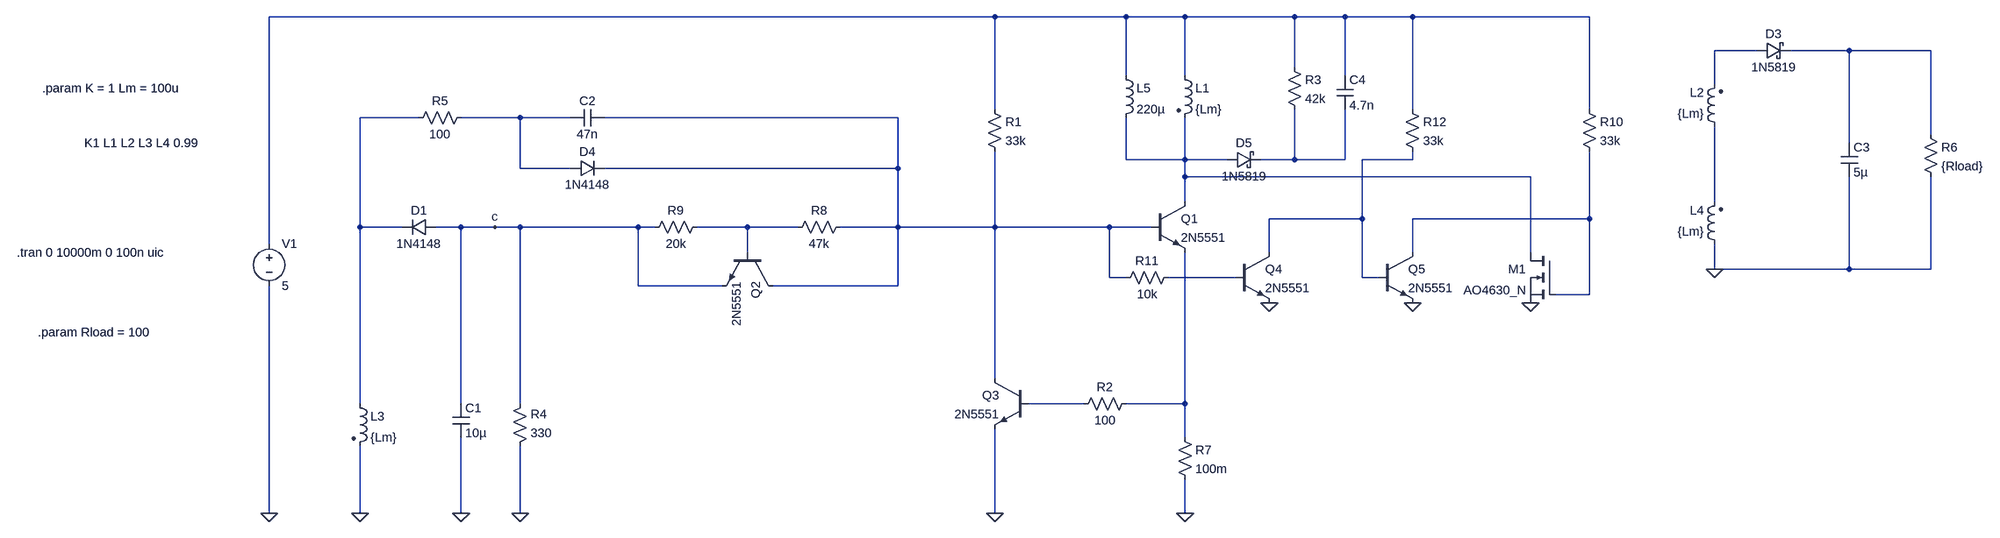
[diagram p0: schematic self_flyback_v4.asc]
self_flyback_v4.asc, the LTspice schematic file:
Version 4
SHEET 1 2740 1060
WIRE 448 -256 -1072 -256
WIRE 704 -256 448 -256
WIRE 816 -256 704 -256
WIRE 1024 -256 816 -256
WIRE 1120 -256 1024 -256
WIRE 1248 -256 1120 -256
WIRE 1584 -256 1248 -256
WIRE 2080 -192 2000 -192
WIRE 2256 -192 2144 -192
WIRE 2624 -192 2256 -192
WIRE 1024 -160 1024 -256
WIRE 704 -144 704 -256
WIRE 816 -144 816 -256
WIRE 1120 -144 1120 -256
WIRE 2000 -128 2000 -192
WIRE 448 -80 448 -256
WIRE 1248 -80 1248 -256
WIRE 1584 -80 1584 -256
WIRE -704 -64 -816 -64
WIRE -512 -64 -624 -64
WIRE -416 -64 -512 -64
WIRE 224 -64 -352 -64
WIRE 2624 -32 2624 -192
WIRE 2256 -16 2256 -192
WIRE 704 16 704 -64
WIRE 816 16 816 -64
WIRE 816 16 704 16
WIRE 896 16 816 16
WIRE 1024 16 1024 -80
WIRE 1024 16 960 16
WIRE 1120 16 1120 -80
WIRE 1120 16 1024 16
WIRE 1248 16 1248 0
WIRE 1248 16 1152 16
WIRE -512 32 -512 -64
WIRE -416 32 -512 32
WIRE 224 32 224 -64
WIRE 224 32 -352 32
WIRE 816 48 816 16
WIRE 1472 48 816 48
WIRE 816 96 816 48
WIRE 2000 96 2000 -48
WIRE 1152 128 1152 16
WIRE 1152 128 976 128
WIRE 1584 128 1584 0
WIRE 1584 128 1248 128
WIRE -816 144 -816 -64
WIRE -736 144 -816 144
WIRE -624 144 -672 144
WIRE -560 144 -624 144
WIRE -512 144 -560 144
WIRE -288 144 -512 144
WIRE -256 144 -288 144
WIRE -80 144 -176 144
WIRE 16 144 -80 144
WIRE 224 144 224 32
WIRE 224 144 96 144
WIRE 448 144 448 0
WIRE 448 144 224 144
WIRE 672 144 448 144
WIRE 752 144 672 144
WIRE -1072 176 -1072 -256
WIRE -80 192 -80 144
WIRE 976 192 976 128
WIRE 1248 192 1248 128
WIRE 1472 192 1472 48
WIRE 2000 224 2000 176
WIRE 2256 224 2256 48
WIRE 2256 224 2000 224
WIRE 2624 224 2624 48
WIRE 2624 224 2256 224
WIRE 672 240 672 144
WIRE 704 240 672 240
WIRE 912 240 784 240
WIRE 1152 240 1152 128
WIRE 1184 240 1152 240
WIRE -288 256 -288 144
WIRE -128 256 -288 256
WIRE 224 256 224 144
WIRE 224 256 -32 256
WIRE 1584 272 1584 128
WIRE 1584 272 1520 272
WIRE 448 432 448 144
WIRE -816 480 -816 144
WIRE -624 480 -624 144
WIRE -512 480 -512 144
WIRE 624 480 512 480
WIRE 816 480 816 192
WIRE 816 480 704 480
WIRE 816 544 816 480
WIRE -1072 688 -1072 256
WIRE -816 688 -816 560
WIRE -624 688 -624 544
WIRE -512 688 -512 560
WIRE 448 688 448 528
WIRE 816 688 816 624
FLAG 448 688 0
FLAG -624 688 0
FLAG -1072 688 0
FLAG 2000 224 0
FLAG -560 144 c
FLAG 816 688 0
FLAG -816 688 0
FLAG -512 688 0
FLAG 976 288 0
FLAG 1472 288 0
FLAG 1248 288 0
SYMBOL npn 752 96 R0
SYMATTR InstName Q1
SYMATTR Value 2N5551
SYMBOL res 432 -96 R0
SYMATTR InstName R1
SYMATTR Value 33k
SYMBOL res 720 464 R90
WINDOW 0 0 56 VBottom 2
WINDOW 3 32 56 VTop 2
SYMATTR InstName R2
SYMATTR Value 100
SYMBOL voltage -1072 160 R0
WINDOW 123 0 0 Left 0
WINDOW 39 0 0 Left 0
SYMATTR InstName V1
SYMATTR Value 5
SYMBOL ind2 800 -160 R0
SYMATTR InstName L1
SYMATTR Value {Lm}
SYMATTR Type ind
SYMBOL ind2 2016 -32 R180
WINDOW 0 36 80 Left 2
WINDOW 3 36 40 Left 2
SYMATTR InstName L2
SYMATTR Value {Lm}
SYMATTR Type ind
SYMBOL ind2 -832 464 R0
SYMATTR InstName L3
SYMATTR Value {Lm}
SYMATTR Type ind
SYMBOL diode -672 128 R90
WINDOW 0 0 32 VBottom 2
WINDOW 3 32 32 VTop 2
SYMATTR InstName D1
SYMATTR Value 1N4148
SYMBOL cap -640 480 R0
SYMATTR InstName C1
SYMATTR Value 10µ
SYMBOL cap -352 -80 R90
WINDOW 0 0 32 VBottom 2
WINDOW 3 32 32 VTop 2
SYMATTR InstName C2
SYMATTR Value 47n
SYMBOL res -720 -48 R270
WINDOW 0 32 56 VTop 2
WINDOW 3 0 56 VBottom 2
SYMATTR InstName R5
SYMATTR Value 100
SYMBOL res 2608 -48 R0
SYMATTR InstName R6
SYMATTR Value {Rload}
SYMBOL cap 2240 -16 R0
SYMATTR InstName C3
SYMATTR Value 5µ
SYMBOL res 800 528 R0
SYMATTR InstName R7
SYMATTR Value 100m
SYMBOL res -528 576 M180
WINDOW 0 36 76 Left 2
WINDOW 3 36 40 Left 2
SYMATTR InstName R4
SYMATTR Value 330
SYMBOL diode -416 48 R270
WINDOW 0 32 32 VTop 2
WINDOW 3 0 32 VBottom 2
SYMATTR InstName D4
SYMATTR Value 1N4148
SYMBOL cap 1104 -144 R0
SYMATTR InstName C4
SYMATTR Value 4.7n
SYMBOL res 1008 -176 R0
SYMATTR InstName R3
SYMATTR Value 42k
SYMBOL schottky 2080 -176 R270
WINDOW 0 32 32 VTop 2
WINDOW 3 0 32 VBottom 2
SYMATTR InstName D3
SYMATTR Value 1N5819
SYMATTR Description Diode
SYMATTR Type diode
SYMBOL ind 688 -160 R0
SYMATTR InstName L5
SYMATTR Value 220µ
SYMBOL ind2 2016 192 R180
WINDOW 0 36 80 Left 2
WINDOW 3 36 40 Left 2
SYMATTR InstName L4
SYMATTR Value {Lm}
SYMATTR Type ind
SYMBOL schottky 896 32 R270
WINDOW 0 32 32 VTop 2
WINDOW 3 0 32 VBottom 2
SYMATTR InstName D5
SYMATTR Value 1N5819
SYMATTR Description Diode
SYMATTR Type diode
SYMBOL npn 512 432 M0
SYMATTR InstName Q3
SYMATTR Value 2N5551
SYMBOL npn -32 192 R90
SYMATTR InstName Q2
SYMATTR Value 2N5551
SYMBOL res 112 128 R90
WINDOW 0 0 56 VBottom 2
WINDOW 3 32 56 VTop 2
SYMATTR InstName R8
SYMATTR Value 47k
SYMBOL res -160 128 R90
WINDOW 0 0 56 VBottom 2
WINDOW 3 32 56 VTop 2
SYMATTR InstName R9
SYMATTR Value 20k
SYMBOL nmos 1520 192 M0
SYMATTR InstName M1
SYMATTR Value AO4630_N
SYMBOL npn 912 192 R0
SYMATTR InstName Q4
SYMATTR Value 2N5551
SYMBOL res 1568 -96 R0
SYMATTR InstName R10
SYMATTR Value 33k
SYMBOL res 800 224 R90
WINDOW 0 0 56 VBottom 2
WINDOW 3 32 56 VTop 2
SYMATTR InstName R11
SYMATTR Value 10k
SYMBOL npn 1184 192 R0
SYMATTR InstName Q5
SYMATTR Value 2N5551
SYMBOL res 1232 -96 R0
SYMATTR InstName R12
SYMATTR Value 33k
TEXT -1856 192 Left 2 !.tran 0 10000m 0 100n uic
TEXT -1728 -16 Left 2 !K1 L1 L2 L3 L4 0.99
TEXT -1808 -120 Left 2 !.param K = 1 Lm = 100u
TEXT -1816 344 Left 2 !.param Rload = 100

The netlist it stands for:
* self_flyback_v4.asc
Q1 N007 N006 N015 0 2N5551
R1 N001 N006 33k
R2 N015 N014 100
V1 N001 0 5
L1 N001 N007 {Lm}
L2 N010 N002 {Lm}
L3 N004 0 {Lm}
D1 c N004 1N4148
C1 c 0 10µ
C2 N006 N005 47n
R5 N004 N005 100
R6 N003 0 {Rload}
C3 N003 0 5µ
R7 N015 0 100m
R4 0 c 330
D4 N005 N006 1N4148
C4 N001 N008 4.7n
R3 N001 N008 42k
D3 N002 N003 1N5819
L5 N001 N007 220µ
L4 0 N010 {Lm}
D5 N007 N008 1N5819
Q3 N006 N014 0 0 2N5551
Q2 N006 N012 c 0 2N5551
R8 N006 N012 47k
R9 N012 c 20k
M1 N007 N011 0 0 AO4630_N
Q4 N009 N013 0 0 2N5551
R10 N001 N011 33k
R11 N013 N006 10k
Q5 N011 N009 0 0 2N5551
R12 N001 N009 33k
.model D D
.lib standard.dio
.model NPN NPN
.model PNP PNP
.lib standard.bjt
.model NMOS NMOS
.model PMOS PMOS
.lib standard.mos
.tran 0 10000m 0 100n uic
K1 L1 L2 L3 L4 0.99
.param K = 1 Lm = 100u
.param Rload = 100
.backanno
.end